# EAGLE design current-amplifier (EAGLE 7.7.0)
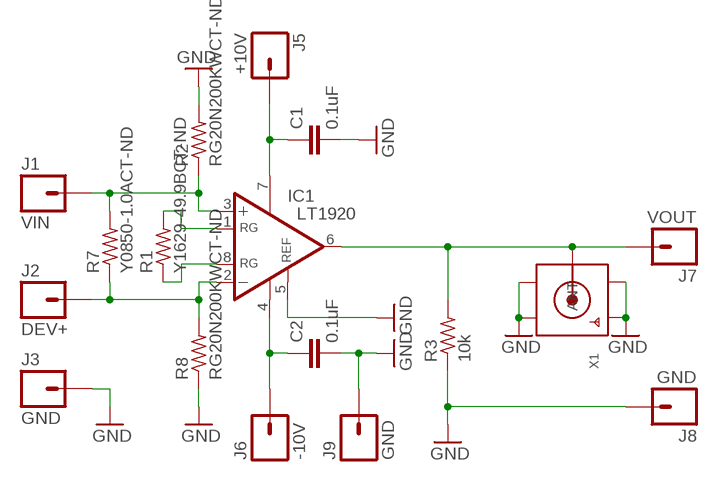
[diagram p0: schematic, sheet 1]

## Parts
C1  0.1uF  C-EUC0805  [C0805]
C2  0.1uF  C-EUC0805  [C0805]
IC1  LT1920  LT1168IS8  [SOIC8]
J1  VIN  M01PTH  [1X01]
J2  DEV+  M01PTH  [1X01]
J3  GND  M01PTH  [1X01]
J5  +10V  M01PTH  [1X01]
J6  -10V  M01PTH  [1X01]
J7  VOUT  M01PTH  [1X01]
J8  GND  M01PTH  [1X01]
J9  GND  M01PTH  [1X01]
R1  Y1629-49.9BCT-ND  R-US_R0805  [R0805]
R2  RG20N200KWCT-ND  R-US_R0805  [R0805]
R3  10k  R-US_R0805  [R0805]
R7  Y0850-1.0ACT-ND  R-US_R2516WIDE  [R2516WIDE]
R8  RG20N200KWCT-ND  R-US_R0805  [R0805]
X1  SMACONNECTOR_EDGE  [SMA_EDGELAUNCH]

## Nets
GND: C1.2 C2.2 IC1.5(REF) J3.1 J8.1 J9.1 R2.2 R3.1 R8.1 X1.GND@1(GND4) X1.GND@2(GND3) X1.GND@3(GND2) X1.GND@4(GND1)
N$1: C1.1 IC1.7(V+) J5.1
N$2: C2.1 IC1.4(V-) J6.1
N$3: IC1.1(RG) R1.2
N$4: IC1.8(RG) R1.1
N$5: IC1.6(OUT) J7.1 R3.2 X1.P(ANT)
N$6: IC1.3(+IN) J1.1 R2.1 R7.B1 R7.B2
N$7: IC1.2(-IN) J2.1 R7.A1 R7.A2 R8.2

## Library data of the parts
C1 C2 = resistor:C-EU: CAPACITOR, European symbol
IC1 = linear-technology:LT1168: Low Power, Single Resistor Gain Programmable, Precision Instrumentation Amplifier SourcE: LT1168.pdf; MPN: LT1168IS8; OC_FARNELL: unknown; OC_NEWARK: 57M2334
J1-J3 J5-J9 = SparkFun-Connectors:M01: Header 1 Standard 1-pin 0.1" header. Use with straight break away headers (SKU : PRT-00116), right angle break away headers (PRT-00553), swiss pins (PRT-00743), machine pins (PRT-00117), and female headers (PRT-00115). SMTSO-256-ET is a "flush mount" nut for a 4-40 screw. The older package used to be too tight, and did not allow it to sit properly thru the drill hit. The latest (0.165DIA) fits nice and snug.
R1-R3 R8 = resistor:R-US_: RESISTOR, American symbol
R7 = rcl:R-US_: RESISTOR, American symbol
X1 = adafruit:SMACONNECTOR: SMA Connector 90° DIP SMA Connector, 50 Ohm (4UConnector: 07259)

## Board
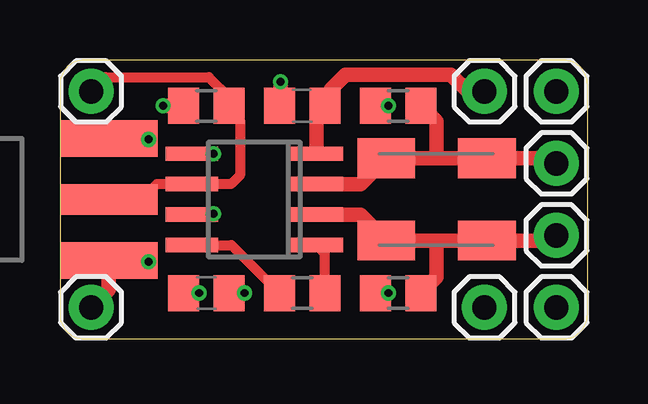
[diagram p1: board, top side]
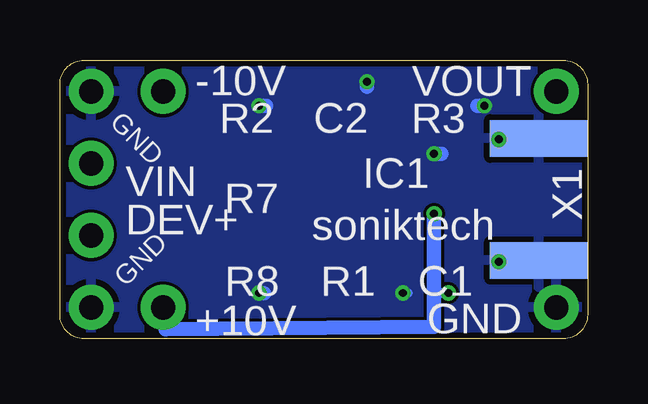
[diagram p2: board, bottom side, seen from below]

Size 22 x 11.6 mm. Coordinates in mm from the lower left corner, seen from the top.
Outline: 0,10.6 0,1 arc90 1,0 21,0 arc90 22,1 22,10.6 arc90 21,11.6 1,11.6 arc90 0,10.6
Copper layers (1*16): Top 0.035mm / dielectric 1.5mm / Bottom 0.035mm
Design rules "MF_Standard_2_Layer": minimum track width 5mil, minimum drill 12mil, track to track 5mil, track to pad 5mil, pad to pad 5mil, via to via 5mil, smd to smd 0mil, copper to edge 10mil, drill to drill 10mil, minimum pad ring 6mil, minimum via ring 6mil, stop-mask expansion 2mil, vias tented up to drill 25mil, thermal gap 10mil

### Footprints (pad centres in the part's own frame; a part is rotated, then mirrored left to right if it is on the bottom)
C0805 = smd 1.3 x 1.5: 1 -0.95,0; 2 0.95,0
SOIC8 = smd 0.6 x 2.2: 1 -1.905,-2.6; 2 -0.635,-2.6; 3 0.635,-2.6; 4 1.905,-2.6; 5 1.905,2.6; 6 0.635,2.6; 7 -0.635,2.6; 8 -1.905,2.6
1X01 = drill 1.016 pad 1.88: 1 0,0
R0805 = smd 1.3 x 1.5: 1 -0.95,0; 2 0.95,0
R2516WIDE = smd 2.41 x 1.65: A1 -2.095,1.715; A2 2.095,1.715; B1 -2.095,-1.715; B2 2.095,-1.715
SMA_EDGELAUNCH = smd 4.064 x 1.524: GND@1 2.032,-2.54; GND@2 2.032,2.54 | smd 4.064 x 1.524 bottom: GND@3 2.032,2.54; GND@4 2.032,-2.54 | smd 4.064 x 1.27: P 2.032,0

### Placement (x,y rotation side)
C1  6.1,1.9 0 top
C2  10.1,9.7 180 top
IC1  8.1,5.8 90 top
J1  20.7,7.3 0 top
J2  20.7,4.3 0 top
J3  1.3,1.3 0 top
J5  17.7,1.3 0 top
J6  17.7,10.3 0 top
J7  1.3,10.3 0 top
J8  20.7,10.3 0 top
J9  20.7,1.3 0 top
R1  10.1,1.9 0 top
R2  14.1,9.7 180 top
R3  6.1,9.7 0 top
R7  15.7,5.8 180 top
R8  14.1,1.9 0 top
X1  0,5.8 0 top

### Tracks (layer width: path | path; a pad name or v marks a point on that pad's centre or on a via)
GND  (via drill 0.33)
  Top 0.406: C1.2 v7.7,1.9
  Top 0.61: R8.1 v13.7,1.9 | R2.2 v13.7,9.7 | C2.2 9.2,9.75 v9.2,10.7 | R3.1 v4.3,9.7 | IC1.5 v6.4,7.7 | J3.1 2.03,2.03 X1.GND@4 | X1.GND@3 2.07,8.3 v3.7,8.3 | v3.7,3.2 3.1,3.2
  Bottom 0.406: v7.7,1.9 7.5,1.9
  Bottom 0.61: v13.7,1.9 13.5,1.9 | v13.7,9.7 13.4,9.7 | v9.2,10.7 9.2,10.5 | v4.3,9.7 4.6,9.7 | v6.4,7.7 6.1,7.7 | v3.7,8.3 3.1,8.3 | X1.GND@4 2.09,3.2 v3.7,3.2
  pour Bottom: 0,12 23,12 23,-1 0,-1
N$1  (via drill 0.33)
  Top 0.406: v6.4,5.2 5.5,5.2 IC1.7 | C1.1 v5.8,1.9
  Bottom 0.406: 6.4,5 v6.4,5.2 | v5.8,1.9 6.4,1.9
  Bottom 0.61: J5.1 17.6,1.3 17.6,0.4 6.4,0.5 6.4,1.9 6.4,5
N$2
  Top 0.406: 10.7,9.35 C2.1
  Top 0.61: J6.1 17,10.3 16.3,11 11.9,11 11.3,10.4 11.3,9.95 C2.1 | IC1.4 10.7,9.35
N$3
  Top 0.406: R1.2 11.05,3.54 IC1.1
N$4
  Top 0.406: IC1.8 7.16,3.9 R1.1
N$5
  Top 0.406: X1.P 2.23,6 3.6,6 4.04,6.43 IC1.6 7.13,6.43 7.5,6.8 7.5,9.1 7.05,9.55 R3.2 7.05,10.05 6.2,10.9 1.9,10.9 J7.1
N$6
  Top 0.61: J1.1 20.48,7.51 R7.B1 15.7,7.51 | 15.7,7.51 R7.B2 12.53,6.43 IC1.3 | R2.1 15.7,9.05 15.7,7.51
N$7
  Top 0.61: IC1.2 12.53,5.17 R7.A2 15.7,4.08 | 15.7,4.08 R7.A1 20.48,4.08 J2.1 | R8.2 15.7,2.55 15.7,4.08

### Text on the board
bNames: soniktech